# EasyEDA Pro project ProProject_gps打窝船_2025-04-29.epro, schematic Schematic2
Create Date: 2025-03-10; Page Name: P1; Project Name: gps打窝船; Schematic Name: Schematic2; Update Date: 2025-04-21; Company: 嘉立创EDA; Page Size: A4; Version: V1.0
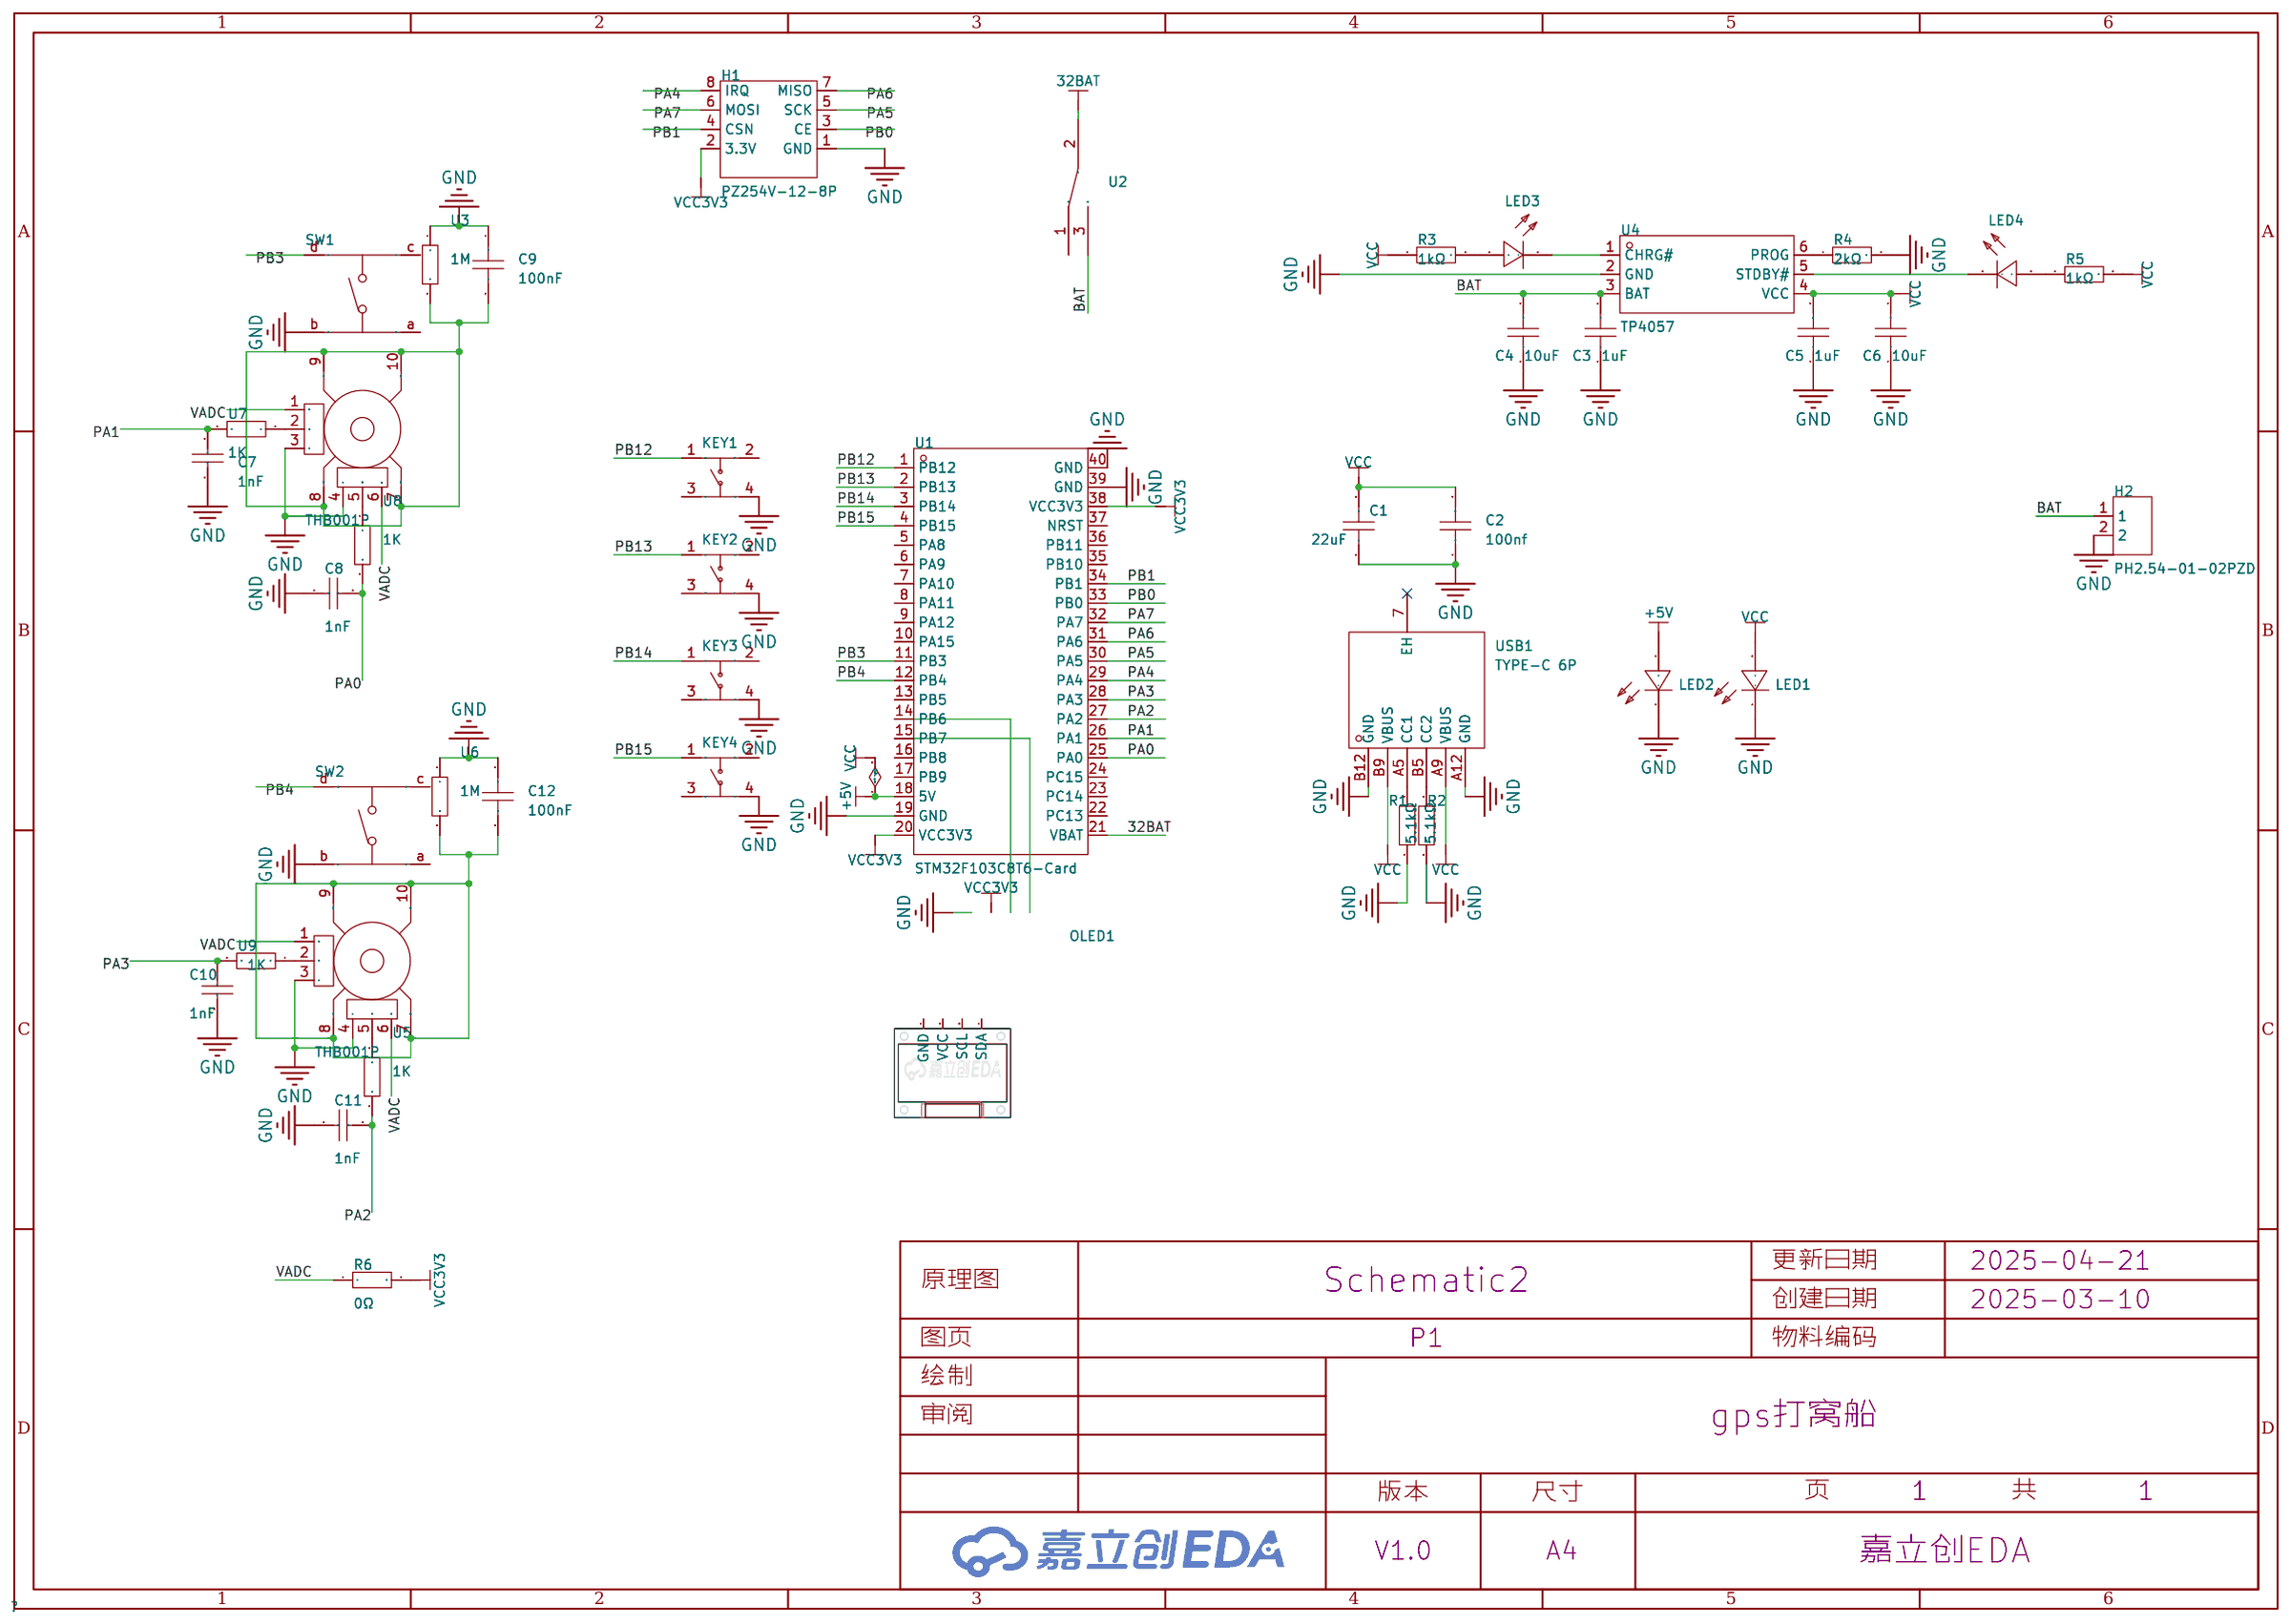
[diagram p0: schematic sheet]

## Parts
C1  22uF  [C0603]
C2  100nf  [C0603]
C3  1uF  [C0603]
C4  10uF  [C0603]
C5  1uF  [C0603]
C6  10uF  [C0603]
C7  1nF  [C0603]
C8  1nF  [C0603]
C9  100nF  [C0603]
C10  1nF  [C0603]
C11  1nF  [C0603]
C12  100nF  [C0603]
H1  PZ254V-12-8P  [HDR-TH_8P-P2.54-V-M-R2-C4-S2.54]
H2  PH2.54-01-02PZD  [HDR-TH_2P-P2.54-V-M-1]
KEY1  KEY_6.5X6.5X5-4P  [KEY-SMD_4P-L6.0-W6.0-P4.00-LS6.7]
KEY2  KEY_6.5X6.5X5-4P  [KEY-SMD_4P-L6.0-W6.0-P4.00-LS6.7]
KEY3  KEY_6.5X6.5X5-4P  [KEY-SMD_4P-L6.0-W6.0-P4.00-LS6.7]
KEY4  KEY_6.5X6.5X5-4P  [KEY-SMD_4P-L6.0-W6.0-P4.00-LS6.7]
LED1  LTST-C190YKT  [LED0603-RD]
LED2  LTST-C190YKT  [LED0603-RD]
LED3  LTST-C190YKT  [LED0603-RD]
LED4  LTST-C190YKT  [LED0603-RD]
OLED1  -  [0.96OLED_4P]
R1  5.1kΩ  [R0603]
R2  5.1kΩ  [R0603]
R3  1kΩ  [R0603]
R4  2kΩ  [R0603]
R5  1kΩ  [R0603]
R6  0Ω  [R0603]
SW1  THB001P  [SW-TH_THB001P]
SW2  THB001P  [SW-TH_THB001P]
U1  STM32F103C8T6-Card  [CONN-TH_L53.3-W22.9_STM32F103C8T6-CARD]
U2  MT-0-102-A101-M200-RS  [SW-TH_MT-0-103-A101-M200-RS]
U3  1M  [R0603]
U4  TP4057  [SOT-23-6_L2.9-W1.6-P0.95-LS2.8-BR]
U5  1K  [R0603]
U6  1M  [R0603]
U7  1K  [R0603]
U8  1K  [R0603]
U9  1K  [R0603]
USB1  TYPE-C 6P  [TYPE-C-SMD_TYPE-C-6P]

## Library data of the parts
C1 C2 = CL10A226MQ8NRNC: 容值:22uF;精度:±20%;额定电压:6.3V;材质(温度系数):X5R;; LCSC Part Name: 22uF ±20% 6.3V; Supplier Part: C59461; Manufacturer: SAMSUNG(三星); Supplier Footprint: 0603; JLCPCB Part Class: 基础库; Datasheet: https://atta.szlcsc.com/upload/public/pdf/source/20160218/1457707763339.pdf; Supplier: LCSC; Tolerance: ±20%; Voltage Rated: 6.3V; Temperature Coefficient: X5R
C3-C6 = CGA0603X5R106K100JT: 容值:10uF;精度:±10%;额定电压:10V;温度系数:X5R;; LCSC Part Name: 10uF ±10% 10V; Supplier Part: C6119842; Manufacturer: HRE(芯声); Supplier Footprint: 0603; Supplier: LCSC; Tolerance: ±10%; Voltage Rating: 10V; Temperature Coefficient: X5R
C7 C8 C10 C11 = CL10B102KB8NNNC: 容值:1nF;精度:±10%;额定电压:50V;材质(温度系数):X7R;; LCSC Part Name: 1nF ±10% 50V; Supplier Part: C1588; Manufacturer: SAMSUNG(三星); Supplier Footprint: 0603; Datasheet: https://atta.szlcsc.com/upload/public/pdf/source/20160218/1457707763339.pdf; Supplier: LCSC; Tolerance: ±10%; Voltage Rated: 50V; Temperature Coefficient: X7R
C9 C12 = CGA0603X7R104K500JT: 容值:100nF;精度:±10%;额定电压:50V;温度系数:X7R;; LCSC Part Name: 100nF ±10% 50V; Supplier Part: C6119867; Manufacturer: HRE(芯声); Supplier Footprint: 0603; Datasheet: https://atta.szlcsc.com/upload/public/pdf/source/20250103/C44077DA9E7B3EFAE02F22B6D3D1CBC9.pdf; Supplier: LCSC; Tolerance: ±10%; Voltage Rating: 50V; Temperature Coefficient: X7R
H1 = PZ254V-12-8P: 插针结构:2x4P;间距:2.54mm;行距:2.54mm;圆针/方针:方针;安装方式:直插;排数:双排;总PIN位数:8P;额定电流:-;额定电压:-;配合针长度:6mm;塑高:2.5mm;端接针长度:3mm;触头材质:黄铜;触头镀层:-;工作温度:-40℃~+105℃;颜色:黑色;; LCSC Part Name: 2x4P 间距:2.54mm 方针 直插; Supplier Part: C492421; Manufacturer: XFCN(兴飞); Supplier Footprint: 插件,P=2.54mm; Datasheet: https://atta.szlcsc.com/upload/public/pdf/source/20200309/C492421_DC8A206AF99CD7755BD4A5B0BC48200B.pdf; Supplier: LCSC; Pin Structure: 2x4P; Pitch: 2.54mm; Row Spacing: 2.54mm; Circluar Pins/Square Pins: 方针; Mounting Type: 直插; Number of Rows: 双排; Number of Pins: 8P; Length of Mating Pin: 6mm; Insulation Height: 2.5mm; Length of End Connection Pin: 3mm; Contact Material: 黄铜; Operating Temperature: -40℃~+105℃; Color: 黑色
H2 = PH2.54-01-02PZD: 插针结构:1x2P;间距:2.54mm;圆针/方针:方针;安装方式:直插;排数:单排;总PIN位数:2P;配合针长度:6mm;塑高:2.5mm;端接针长度:3mm;触头材质:黄铜;工作温度:-40℃~+105℃;颜色:黑色;; LCSC Part Name: 1x2P 间距:2.54mm 方针 直插; Supplier Part: C7501580; Manufacturer: XUNPU(讯普); Supplier Footprint: 插件,P=2.54mm; Datasheet: https://atta.szlcsc.com/upload/public/pdf/source/20230815/30A24B1E4B9BDE2239C7F8E56770F33B.pdf; Supplier: LCSC; Pin Structure: 1x2P; Pitch: 2.54mm; Circluar Pins/Square Pins: 方针; Mounting Type: 直插; Number of Rows: 单排; Number of Pins: 2P; Length of Mating Pin: 6mm; Insulation Height: 2.5mm; Length of End Connection Pin: 3mm; Contact Material: 黄铜; Operating Temperature: -40℃~+105℃; Color: 黑色
KEY1-KEY4 = KEY_6.5X6.5X5-4P: Supplier Part: C9900018298; Supplier Footprint: KEY-SMD_4P; JLCPCB Part Class: 扩展库; Supplier: LCSC
LED1-LED4 = LTST-C190YKT: 发光颜色:黄色;正向电压(VF):2.1V;功率:60mW;正向电流:20mA;主波长:588nm;二极管配置:-;透镜颜色:无色透明透镜;色温:-;发光强度:6mcd;发光角度:130°;载带方式:-;工作温度:-55℃~+85℃;; LCSC Part Name: 黄灯; Supplier Part: C125097; Manufacturer: LITEON(光宝); Supplier Footprint: 0603; Datasheet: https://atta.szlcsc.com/upload/public/pdf/source/20180326/C125097_8A610ECE31461EDC7D081EA09A856E73.pdf; Supplier: LCSC; Emitted Color: 黄色; Forward Voltage (VF): 2.1V; Power Dissipation: 60mW; Forward Current: 20mA; Dominant Wavelength: 588nm; Peak Wavelength: 585nm; Lens Color: 无色透明透镜; Luminous Intensity: 6mcd; Viewing Angle: 130°; Operating Temperature: -55℃~+85℃
OLED1 = 0.96OLED模块_4P: Supplier Footprint: 插件
R1 R2 = 0603WAF5101T5E: 电阻类型:厚膜电阻;阻值:5.1kΩ;精度:±1%;功率:100mW;最大工作电压:75V;温度系数:±100ppm/℃;; LCSC Part Name: 5.1kΩ ±1% 100mW 厚膜电阻; Supplier Part: C23186; Manufacturer: UNI-ROYAL(厚声); Supplier Footprint: 0603; Datasheet: https://atta.szlcsc.com/upload/public/pdf/source/20200306/C422600_1E6D84923E4A46A82E41ADD87F860B5C.pdf; Supplier: LCSC; Type: 厚膜电阻; Tolerance: ±1%; Power(Watts): 100mW; Overload Voltage (Max): 75V; Temperature Coefficient: ±100ppm/℃; Operating Temperature Range: -55℃~+155℃
R3 R5 = 0603WAF1001T5E: 电阻类型:厚膜电阻;阻值:1kΩ;精度:±1%;功率:100mW;最大工作电压:75V;温度系数:±100ppm/℃;; LCSC Part Name: 1kΩ ±1% 100mW 厚膜电阻; Supplier Part: C21190; Manufacturer: UNI-ROYAL(厚声); Supplier Footprint: 0603; Datasheet: https://atta.szlcsc.com/upload/public/pdf/source/20200306/C422600_1E6D84923E4A46A82E41ADD87F860B5C.pdf; Supplier: LCSC; Type: 厚膜电阻; Tolerance: ±1%; Power(Watts): 100mW; Overload Voltage (Max): 75V; Temperature Coefficient: ±100ppm/℃; Operating Temperature Range: -55℃~+155℃
R4 = 0603WAF2001T5E: 电阻类型:厚膜电阻;阻值:2kΩ;精度:±1%;功率:100mW;最大工作电压:75V;温度系数:±100ppm/℃;; LCSC Part Name: 2kΩ ±1% 100mW 厚膜电阻; Supplier Part: C22975; Manufacturer: UNI-ROYAL(厚声); Supplier Footprint: 0603; Datasheet: https://atta.szlcsc.com/upload/public/pdf/source/20200306/C422600_1E6D84923E4A46A82E41ADD87F860B5C.pdf; Supplier: LCSC; Type: 厚膜电阻; Tolerance: ±1%; Power(Watts): 100mW; Overload Voltage (Max): 75V; Temperature Coefficient: ±100ppm/℃; Operating Temperature Range: -55℃~+155℃
R6 = 0603WAF0000T5E: 电阻类型:厚膜电阻;阻值:0Ω;精度:±1%;功率:100mW;最大工作电压:75V;; LCSC Part Name: 0Ω ±1% 100mW 厚膜电阻; Supplier Part: C21189; Manufacturer: UNI-ROYAL(厚声); Supplier Footprint: 0603; Datasheet: https://atta.szlcsc.com/upload/public/pdf/source/20200306/C422600_1E6D84923E4A46A82E41ADD87F860B5C.pdf; Supplier: LCSC; Type: 厚膜电阻; Tolerance: ±1%; Power(Watts): 100mW; Overload Voltage (Max): 75V; Operating Temperature Range: -55℃~+155℃
SW1 SW2 = THB001P: 带有多功能, 高质量的双轴杠杆和集成的中心选择开关 适用于航模玩具遥控器电位器、3D摇杆PS4手柄游戏机、无人机摇杆电位器、工业控制器; LCSC Part Name: 微型指拨摇杆开关; Supplier Part: C2685355; Manufacturer: C&K; Supplier Footprint: 插件-14P,17x21mm; Datasheet: https://atta.szlcsc.com/upload/public/pdf/source/20210114/C2685355_98E98C84804317E8B305B6FAD3A93D12.pdf; Supplier: LCSC
U1 = STM32F103C8T6-Card: Supplier Part: C9900077949; Supplier Footprint: 插件; Supplier: LCSC
U2 = MT-0-102-A101-M200-RS: 电路结构:单刀双掷;机械寿命:-;额定电流:5A;额定电压(AC):125V;安装方式:直插;; LCSC Part Name: 小型钮子三脚二档 五件套; Supplier Part: C1788492; Manufacturer: YUEN FUNG(源丰); Supplier Footprint: 插件; Datasheet: https://atta.szlcsc.com/upload/public/pdf/source/20230720/8E5C36EFDF374AE4FF4AC09DB233CE0E.pdf; Supplier: LCSC; Circuit: 单刀双掷; Switch Length: 13mm; Switch Width: 8mm; Switch Height: 28.6mm; Contact Current: 5A; Voltage Rating (AC): 125V; Actuator Type: 圆柱钮柄; Pin Style: 焊片; Mounting Style: 直插; Operating Temperature: -25℃~+85℃
U3 U5-U9 = Res_0603: Supplier Footprint: 0603
U4 = TP4057: 电源电压:6.5V;最大充电电流:500mA;电池类型:锂离子/聚合物;电池节数:1;; Supplier Part: C725791; Manufacturer: UMW(友台半导体); Supplier Footprint: SOT-23-6; Datasheet: https://atta.szlcsc.com/upload/public/pdf/source/20231109/7FB39B0490CD1514A6792371FCA0BB30.pdf; Supplier: LCSC; Supply Voltage: 6.5V; Maximum Charge Current: 500mA; Type of Battery: 锂离子/聚合物; Number of Cells: 1; Operating Temperature: -40℃~+85℃
USB1 = TYPE-C 6P: 连接器类型:Type-C;标准:USB 3.1;公母:母;安装方式:卧贴;触点数量:6P;端口数量:1;额定电流 - 电源:5A;工作温度范围:-40℃~+85℃;; LCSC Part Name: Type-C 母 卧贴; Supplier Part: C456012; Manufacturer: SHOU HAN(首韩); Supplier Footprint: SMD; Datasheet: https://atta.szlcsc.com/upload/public/pdf/source/20201203/C456012_B13F72044DF846EDBE9BDD0D1D3CD166.pdf; Supplier: LCSC; Connector Type: Type-C; Standard: USB 3.1; Gender: 母; Mounting Style: 卧贴; Number of Contacts: 6P; Number of Ports: 1; Current Rating - Power (Max): 5A; Operating Temperature Range: -40℃~+85℃; Rated Voltage (Max): 20V; Connect-Disconnect Life: 3千次; Core Colour: 黑色

## Nets
+5V: C1.2 C2.2 C5.2 C6.2 LED1.2(+) LED2.2(+) R3.1 R5.2 U1.18(5V) U4.4(VCC) USB1.A9(VBUS) USB1.B9(VBUS)
GND: C1.1 C2.1 C3.1 C4.1 C5.1 C6.1 C7.2 C8.1 C9.1 C10.2 C11.1 C12.1 H1.1(GND) H2.2 KEY1.4 KEY2.4 KEY3.4 KEY4.4 LED1.1(-) LED2.1(-) R1.2 R2.2 R4.2 SW1.3(A) SW1.4(A) SW1.b SW2.3(A) SW2.4(A) SW2.b U1.19(GND) U1.39(GND) U1.40(GND) U3.1 U4.2(GND) U6.1 USB1.A12(GND) USB1.B12(GND)
VCC3V3: H1.2(3.3V) R6.2 U1.20(VCC3V3) U1.38(VCC3V3)
32BAT: U1.21(VBAT) U2.2
BAT: C3.2 C4.2 H2.1 U2.3 U4.3(BAT)
PA0: C8.2 U1.25(PA0) U8.2
PA1: C7.1 U1.26(PA1) U7.2
PA2: C11.2 U1.27(PA2) U5.2
PA3: C10.1 U1.28(PA3) U9.2
PA4: H1.8(IRQ) U1.29(PA4)
PA5: H1.5(SCK) U1.30(PA5)
PA6: H1.7(MISO) U1.31(PA6)
PA7: H1.6(MOSI) U1.32(PA7)
PB0: H1.3(CE) U1.33(PB0)
PB1: H1.4(CSN) U1.34(PB1)
PB3: SW1.d U1.11(PB3)
PB4: SW2.d U1.12(PB4)
PB12: KEY1.1 U1.1(PB12)
PB13: KEY2.1 U1.2(PB13)
PB14: KEY3.1 U1.3(PB14)
PB15: KEY4.1 U1.4(PB15)
VADC: R6.1 SW1.1(B) SW1.6(B) SW2.1(B) SW2.6(B)
$1N765: R1.1 USB1.A5(CC1)
$1N804: R2.1 USB1.B5(CC2)
$1N3595: LED3.1(-) U4.1(CHRG#)
$1N3637: LED3.2(+) R3.2
$1N3713: R4.1 U4.6(PROG)
$1N3983: LED4.1(-) U4.5(STDBY#)
$1N4198: LED4.2(+) R5.1
$1N5842: SW1.2(DTA) U7.1
$1N5916: SW1.5(DTA) U8.1
$1N7403: C9.2 SW1.7(GND) SW1.8(GND) SW1.9(GND) SW1.10(GND) U3.2
$1N7897: SW2.2(DTA) U9.1
$1N7914: SW2.5(DTA) U5.1
$1N7915: C12.2 SW2.7(GND) SW2.8(GND) SW2.9(GND) SW2.10(GND) U6.2

Not connected (* = marked no-connect by the designer): KEY1 2 3; KEY2 2 3; KEY3 2 3; KEY4 2 3; OLED1 1(GND) 2(VCC) 3(SCL) 4(SDA); SW1 a c; SW2 a c; U1 5(PA8) 6(PA9) 7(PA10) 8(PA11) 9(PA12) 10(PA15) 13(PB5) 14(PB6) 15(PB7) 16(PB8) 17(PB9) 22(PC13) 23(PC14) 24(PC15) 35(PB10) 36(PB11) 37(NRST); U2 1; USB1 7(EH)*
